# EAGLE schematic CzujnikWilgotnosciGleby_Rafal.Brauner (EAGLE 9.6.2)
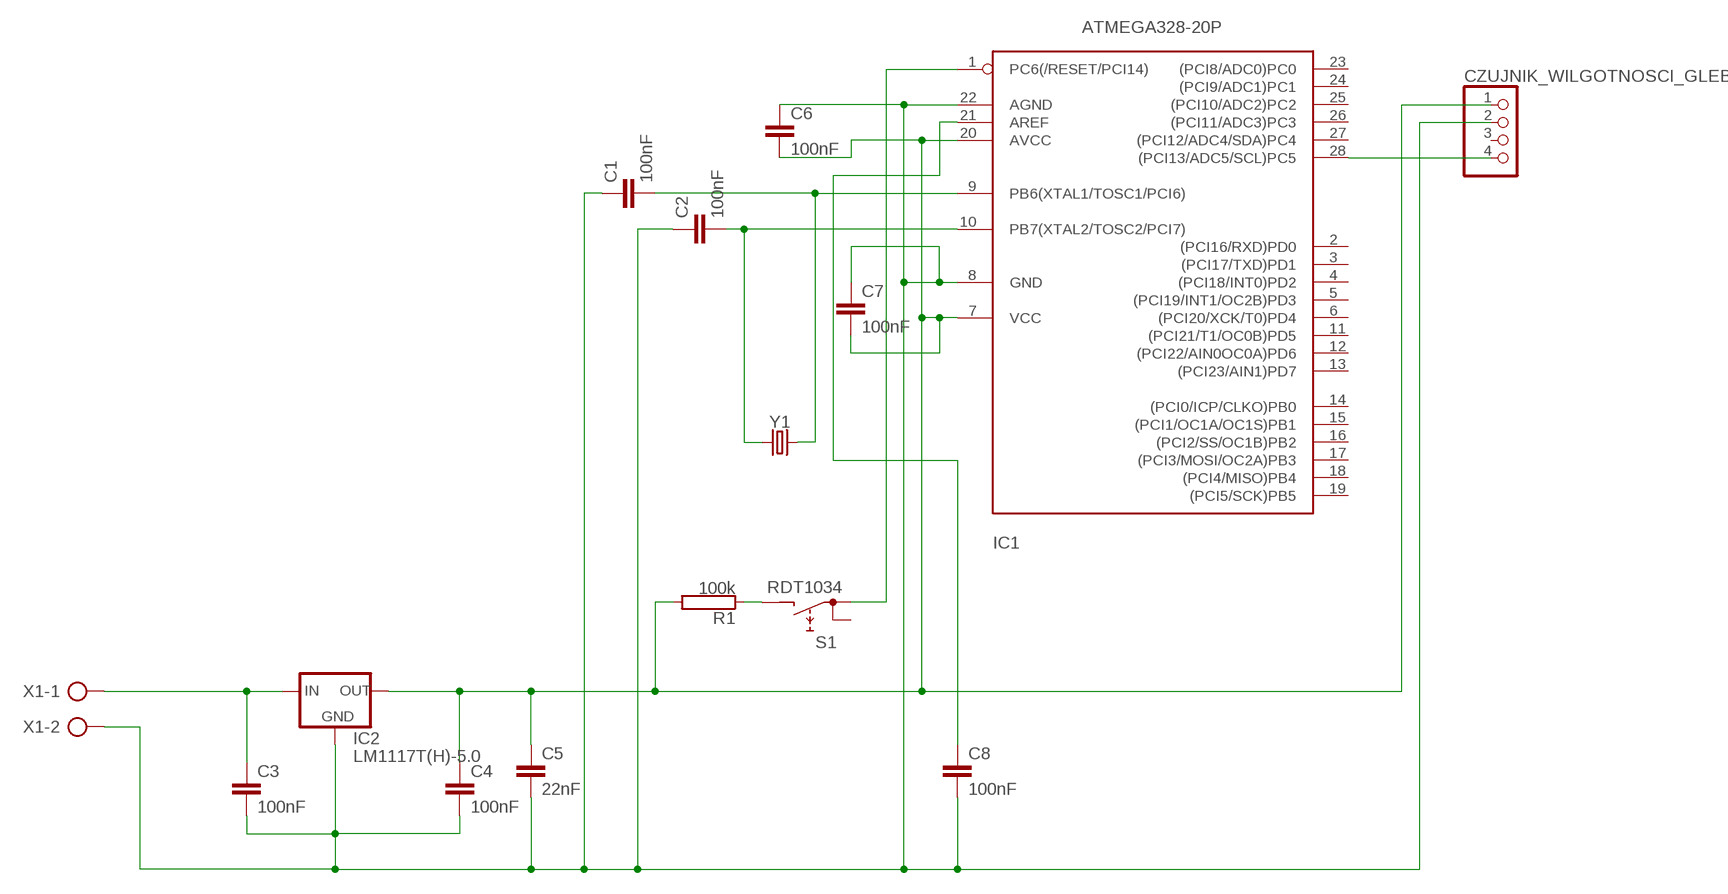
[diagram p0: schematic, sheet 1]

## Parts
C1  100nF  C2,5-3  [C2.5-3]
C2  100nF  C2,5-3  [C2.5-3]
C3  100nF  C2,5-3  [C2.5-3]
C4  100nF  C2,5-3  [C2.5-3]
C5  22nF  C2,5-3  [C2.5-3]
C6  100nF  C2,5-3  [C2.5-3]
C7  100nF  C2,5-3  [C2.5-3]
C8  100nF  C2,5-3  [C2.5-3]
CZUJNIK_WILGOTNOSCI_GLEBY  PINHD-1X4  [1X04]
IC1  ATMEGA328-20P  [DIL28-3]
IC2  LM1117T(H)-5.0  [TO220H]
R1  100k  RAC01  [AC01]
S1  RDT1034  [RDT1034]
X1  AK300/2  [AK300/2]
Y1  CRYSTALPTH-HC49US  [HC49US]

## Nets
N$1: C3.1 IC2.3(IN) X1.1
N$2: C4.1 C5.1 C6.2 C7.2 CZUJNIK_WILGOTNOSCI_GLEBY.1 IC1.7(VCC) IC1.20(AVCC) IC2.2(OUT) R1.2
N$3: C1.1 C2.1 C3.2 C4.2 C5.2 C6.1 C7.1 C8.2 CZUJNIK_WILGOTNOSCI_GLEBY.2 IC1.8(GND) IC1.22(AGND) IC2.1(GND) X1.2
N$4: IC1.1(PC6(/RESET/PCI14)) S1.A1
N$5: R1.1 S1.B
N$6: C1.2 IC1.9(PB6(XTAL1/TOSC1/PCI6)) Y1.2
N$7: C8.1 IC1.21(AREF)
N$8: C2.2 IC1.10(PB7(XTAL2/TOSC2/PCI7)) Y1.1
N$12: CZUJNIK_WILGOTNOSCI_GLEBY.4 IC1.28((PCI13/ADC5/SCL)PC5)
Unconnected: CZUJNIK_WILGOTNOSCI_GLEBY.3 IC1.2((PCI16/RXD)PD0) IC1.3((PCI17/TXD)PD1) IC1.4((PCI18/INT0)PD2) IC1.5((PCI19/INT1/OC2B)PD3) IC1.6((PCI20/XCK/T0)PD4) IC1.11((PCI21/T1/OC0B)PD5) IC1.12((PCI22/AIN0OC0A)PD6) IC1.13((PCI23/AIN1)PD7) IC1.14((PCI0/ICP/CLKO)PB0) IC1.15((PCI1/OC1A/OC1S)PB1) IC1.16((PCI2/SS/OC1B)PB2) IC1.17((PCI3/MOSI/OC2A)PB3) IC1.18((PCI4/MISO)PB4) IC1.19((PCI5/SCK)PB5) IC1.23((PCI8/ADC0)PC0) IC1.24((PCI9/ADC1)PC1) IC1.25((PCI10/ADC2)PC2) IC1.26((PCI11/ADC3)PC3) IC1.27((PCI12/ADC4/SDA)PC4) S1.A

## Library data of the parts
C1-C8 = capacitor-wima:C: CAPACITOR naming: grid - package width
CZUJNIK_WILGOTNOSCI_GLEBY = pinhead:PINHD-1X4: PIN HEADER
IC1 = atmega328_Rafal.Brauner:ATMEGA328*P: MICROCONTROLLER 32 kBytes FLASH 2 kBytes SRAM 1 kBytes EEPROM USART 8-channel 10 bit ADC
IC2 = lm1117_10:LM1117?-*: 800mA Low-Dropout Linear Regulator Source: http://www.ti.com/lit/ds/symlink/lm1117-n.pdf; MF: Texas Instruments; MPN: LM1117T-5.0; OC_FARNELL: 1215183; OC_NEWARK: 41K3491
R1 = resistor-power:R: Power Resitor; OC_FARNELL: unknown; OC_NEWARK: unknown
S1 = switch:RDT1034: PUSH SWITCH www.radiohm.com
X1 = con-ptr500:AK300/2: CONNECTOR; OC_FARNELL: unknown; OC_NEWARK: unknown
Y1 = SparkFun-Clocks:CRYSTAL: Crystals (Generic) These are passive quartz crystals, which can be used as a clock source for a microcontroller. Crystal's are two-terminal devices. They require external "load" capacitors to generate an oscillating signal.